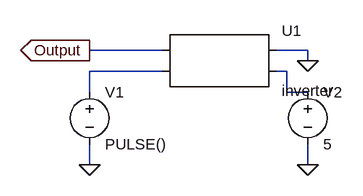
[diagram p0: schematic Draft2.asc]
Draft2.asc, the LTspice schematic file:
Version 4
SHEET 1 880 680
WIRE 128 144 16 144
WIRE 352 144 304 144
WIRE 352 160 352 144
WIRE 128 176 16 176
WIRE 320 176 304 176
WIRE 16 208 16 176
WIRE 320 208 320 176
WIRE 352 208 320 208
WIRE 16 320 16 288
WIRE 352 320 352 288
FLAG 16 320 0
FLAG 352 320 0
FLAG 352 160 0
FLAG 16 144 Output
IOPIN 16 144 Out
SYMBOL AutoGenerated\\inverter 208 160 R0
SYMATTR InstName U1
SYMBOL voltage 16 192 R0
WINDOW 123 0 0 Left 0
WINDOW 39 0 0 Left 0
SYMATTR InstName V1
SYMATTR Value PULSE()
SYMBOL voltage 352 192 R0
WINDOW 123 0 0 Left 0
WINDOW 39 0 0 Left 0
SYMATTR InstName V2
SYMATTR Value 5

The netlist it stands for:
* Draft2.asc
* U1: inverter (symbol AutoGenerated\inverter not available, pins judged from their places): pin1=Output pin2=N001 pin3=0 pin4=N002
V1 N001 0 PULSE()
V2 N002 0 5
.backanno
.end